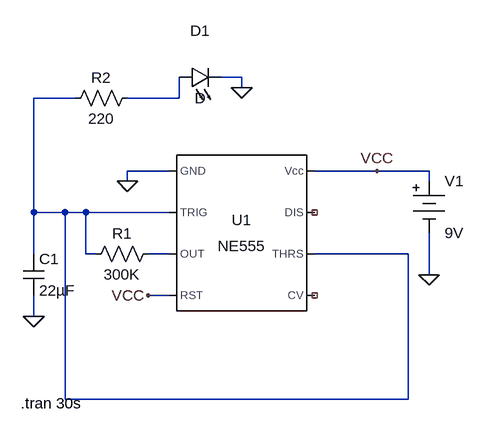
[diagram p0: schematic NotWorking.asc]
NotWorking.asc, the LTspice schematic file:
Version 4
SHEET 1 880 680
WIRE 224 -64 192 -64
WIRE 224 -48 224 -64
WIRE -32 -32 -96 -32
WIRE 128 -32 128 -64
WIRE 128 -32 48 -32
WIRE 112 80 48 80
WIRE 432 80 336 80
WIRE 512 80 432 80
WIRE 48 96 48 80
WIRE 512 96 512 80
WIRE -96 144 -96 -32
WIRE -48 144 -96 144
WIRE -16 144 -48 144
WIRE 112 144 -16 144
WIRE -96 208 -96 144
WIRE -16 208 -16 144
WIRE 0 208 -16 208
WIRE 112 208 80 208
WIRE 480 208 336 208
WIRE 512 240 512 176
WIRE 112 272 80 272
WIRE -96 304 -96 272
WIRE -48 432 -48 144
WIRE 480 432 480 208
WIRE 480 432 -48 432
FLAG 48 96 0
FLAG 512 240 0
FLAG 432 80 VCC
FLAG 80 272 VCC
FLAG 224 -48 0
FLAG -96 304 0
SYMBOL Misc\\NE555 224 176 R0
SYMATTR InstName U1
SYMBOL cap -112 208 R0
SYMATTR InstName C1
SYMATTR Value 22µF
SYMBOL Misc\\battery 512 80 R0
WINDOW 123 0 0 Left 2
WINDOW 39 0 0 Left 2
SYMATTR InstName V1
SYMATTR Value 9V
SYMBOL res 96 192 R90
WINDOW 0 0 56 VBottom 2
WINDOW 3 32 56 VTop 2
SYMATTR InstName R1
SYMATTR Value 300K
SYMBOL LED 128 -48 R270
WINDOW 0 72 32 VTop 2
WINDOW 3 0 32 VBottom 2
SYMATTR InstName D1
SYMBOL res 64 -48 R90
WINDOW 0 0 56 VBottom 2
WINDOW 3 32 56 VTop 2
SYMATTR InstName R2
SYMATTR Value 220
TEXT -116 438 Left 2 !.tran 30s

The netlist it stands for:
* NotWorking.asc
XU1 0 N001 N003 VCC NC_01 N001 NC_02 VCC NE555  ; pins GND TRIG OUT RST CV THRS DIS Vcc
C1 N001 0 22µF
V1 VCC 0 9V
R1 N003 N001 300K
D1 N002 0 D
R2 N002 N001 220
.model D D
.lib standard.dio
.tran 30s
.lib NE555.sub
.backanno
.end